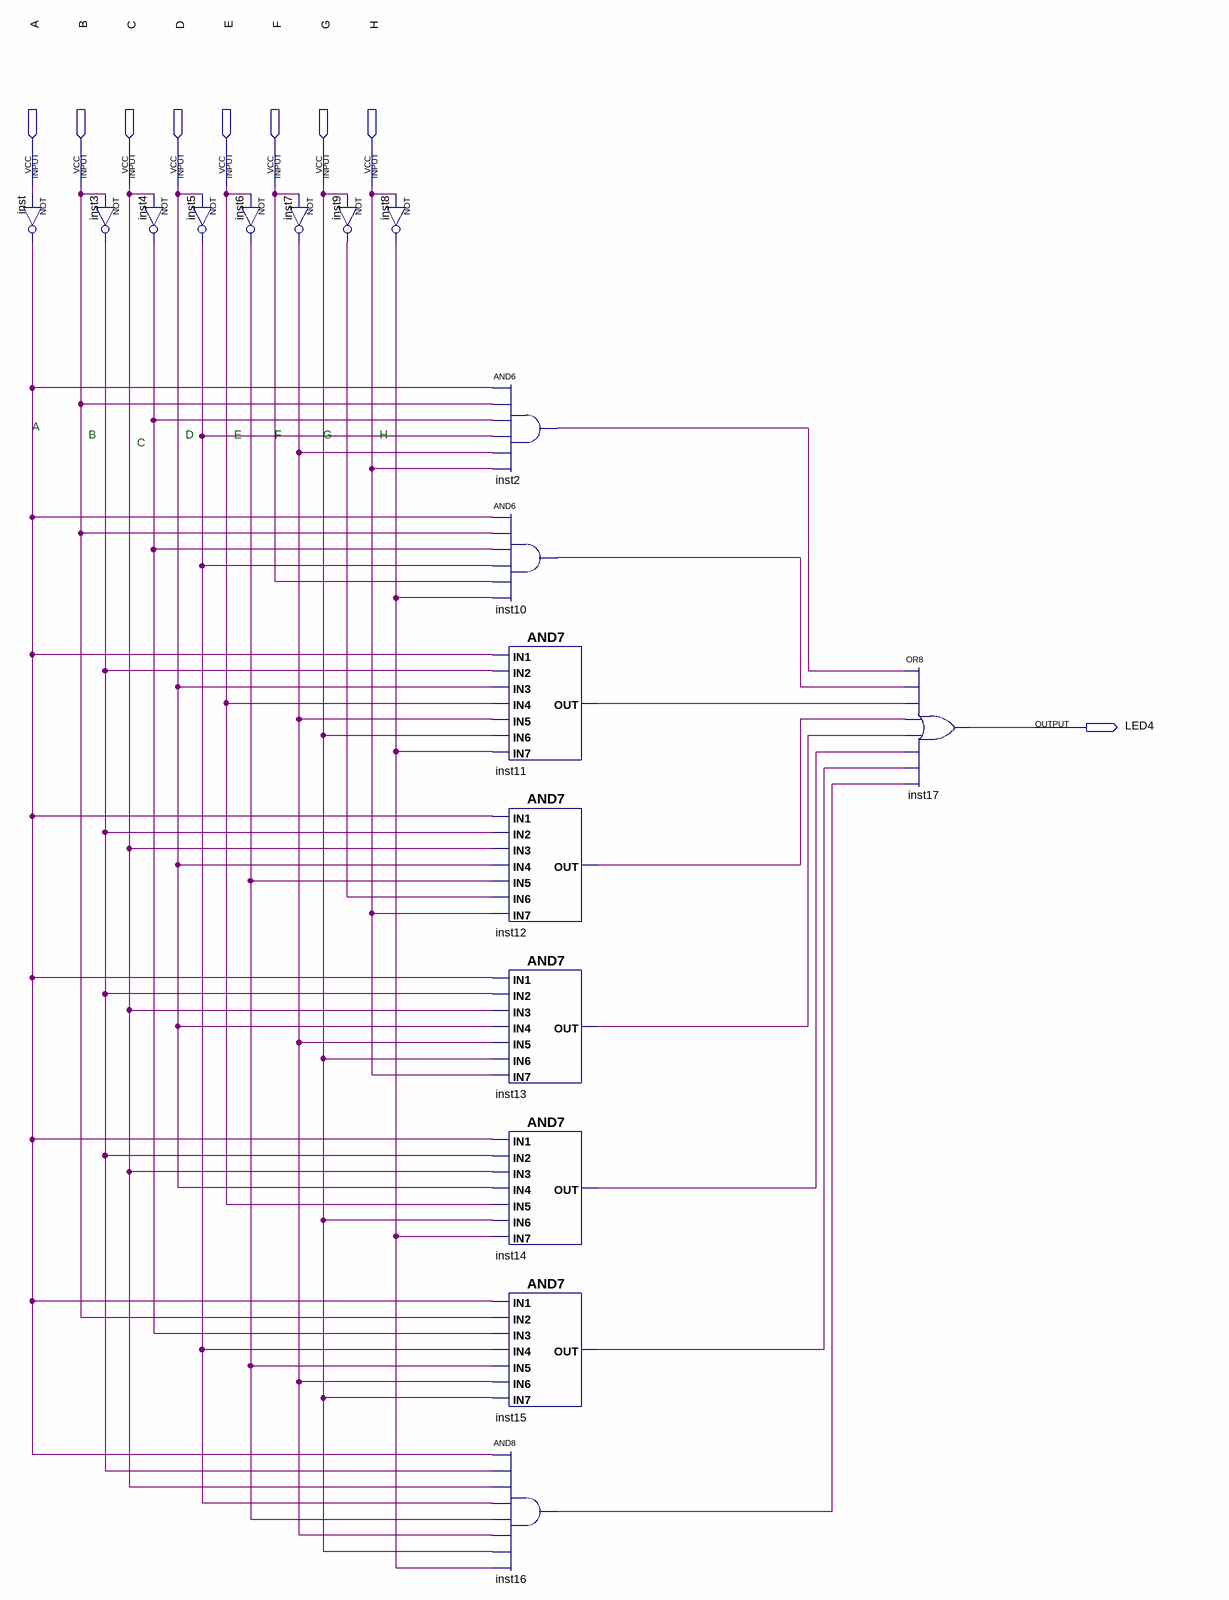
[diagram p0: schematic sheet]
// Quartus schematic LED4.bdf as structural Verilog: 17 symbols, 9 pins
module LED4 (
  input  A,
  input  B,
  input  C,
  input  D,
  input  E,
  input  F,
  input  G,
  input  H,
  output LED4
);

  wire inst2_out, inst3_out, inst4_out, inst5_out, inst6_out, inst7_out, inst8_out, inst9_out, inst10_out,
       inst11_out, inst12_out, inst13_out, inst14_out, inst15_out, inst16_out, inst_out;

  not inst (inst_out, A);
  not inst3 (inst3_out, B);
  not inst4 (inst4_out, C);
  not inst5 (inst5_out, D);
  not inst6 (inst6_out, E);
  not inst7 (inst7_out, F);
  not inst9 (inst9_out, G);
  not inst8 (inst8_out, H);
  and inst2 (inst2_out, inst_out, B, inst4_out, inst5_out, inst7_out, H);
  and inst10 (inst10_out, inst_out, B, inst4_out, inst5_out, F, inst8_out);
  and inst11 (inst11_out, inst_out, inst3_out, D, E, inst7_out, G, inst8_out);
  and inst12 (inst12_out, inst_out, inst3_out, C, D, inst6_out, inst9_out, H);
  and inst13 (inst13_out, inst_out, inst3_out, C, D, inst7_out, G, H);
  and inst14 (inst14_out, inst_out, inst3_out, C, D, E, G, inst8_out);
  and inst15 (inst15_out, inst_out, B, inst4_out, inst5_out, inst6_out, inst7_out, G);
  and inst16 (inst16_out, inst_out, inst3_out, C, inst5_out, inst6_out, inst7_out, G, inst8_out);
  or inst17 (LED4, inst2_out, inst10_out, inst11_out, inst12_out, inst13_out, inst14_out, inst15_out, inst16_out);

  // Notes on the sheet:
  //   A
  //   B
  //   D
  //   E
  //   F
  //   G
  //   H
  //   C
endmodule
